# EAGLE schematic board1 (EAGLE 6.1)
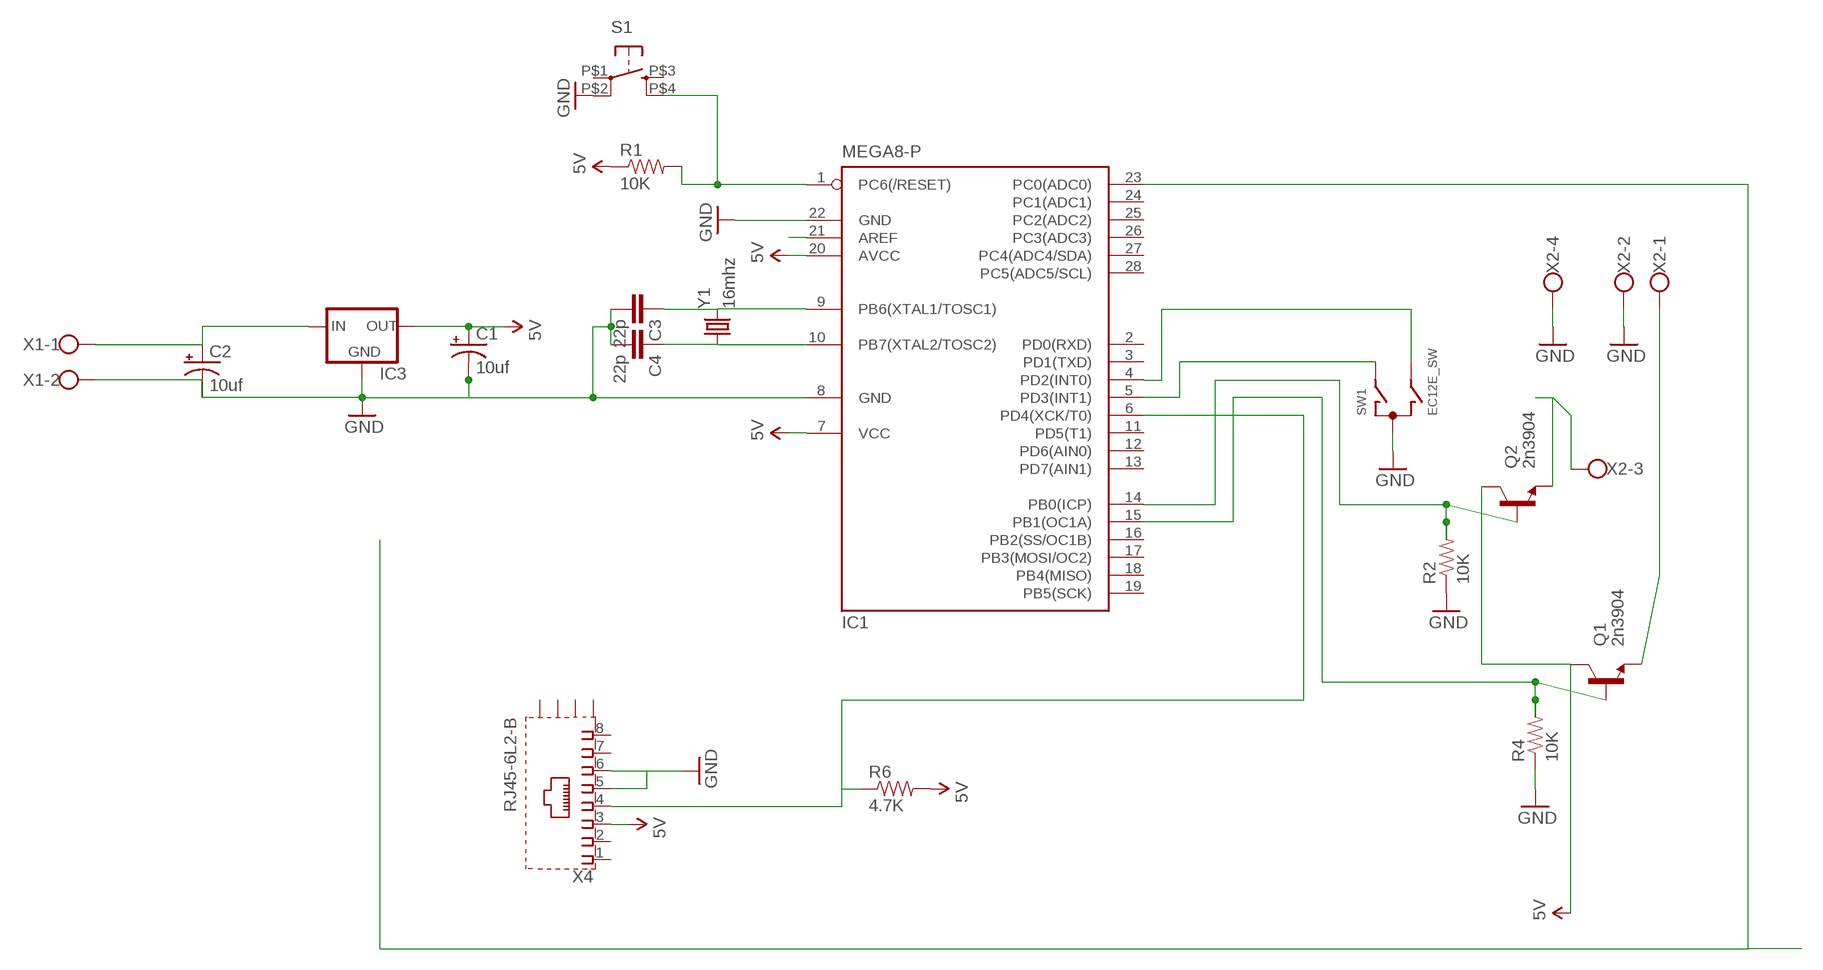
[diagram p0: schematic, sheet 1]

## Parts
C1  10uf  CAP_POLPTH2  [CPOL-RADIAL-10UF-25V]
C2  10uf  CAP_POLPTH2  [CPOL-RADIAL-10UF-25V]
C3  22p  CAP_  [AXIAL-5MM]
C4  22p  CAP_  [AXIAL-5MM]
IC1  MEGA8-P  [DIL28-3]
IC3  V_REG_78XXSINK  [TO220-IGO]
Q1  2n3904  TRANSISTOR_NPNTO-92-AMMO  [TO-92-AMMO]
Q2  2n3904  TRANSISTOR_NPNTO-92-AMMO  [TO-92-AMMO]
R1  10K  RESISTORAXIAL-0.3  [AXIAL-0.3]
R2  10K  RESISTORAXIAL-0.3  [AXIAL-0.3]
R4  10K  RESISTORAXIAL-0.3  [AXIAL-0.3]
R6  4.7K  RESISTORKIT  [AXIAL-0.3-KIT]
S1  TAC_SWITCHKSA_SEALED  [KSA_SEALED_TAC_SWITCH]
SW1  EC12E_SW  [ALPS_EC12E_SW]
X1  W237-102  [W237-102]
X2  W237-4  [W237-4]
X4  RJ45-6L2-B  [RJ45-SHIELD2]
Y1  16mhz  CRYSTALHC49US  [HC49US]

## Nets
5V: C1.1(+) IC1.7(VCC) IC1.20(AVCC) IC3.OUT Q1.3(C) Q2.3(C) R1.P$1 R6.P$2 X4.3
DALLASONEWIREBUS: IC1.6(PD4(XCK/T0)) R6.P$1 X4.4
GND: C1.2(-) C2.2(-) C3.P$2 C4.P$2 IC1.8(GND) IC1.22(GND) IC3.GND R2.P$1 R4.P$1 S1.P$2 SW1.C X1.2 X2.2 X2.4 X4.5 X4.6
N$1: IC1.1(PC6(/RESET)) R1.P$2 S1.P$4
N$2: C2.1(+) IC3.IN X1.1
N$3: C3.P$1 IC1.9(PB6(XTAL1/TOSC1)) Y1.2
N$4: C4.P$1 IC1.10(PB7(XTAL2/TOSC2)) Y1.1
N$5: IC1.4(PD2(INT0)) SW1.B
N$6: IC1.23(PC0(ADC0))
N$7: IC1.5(PD3(INT1)) SW1.A
N$14: IC1.15(PB1(OC1A)) Q1.2(B) R4.P$2
N$26: IC1.21(AREF)
N$28: Q2.1(E) X2.3
N$30: Q1.1(E) X2.1
N$31: IC1.14(PB0(ICP)) Q2.2(B) R2.P$2
Unconnected: IC1.2(PD0(RXD)) IC1.3(PD1(TXD)) IC1.11(PD5(T1)) IC1.12(PD6(AIN0)) IC1.13(PD7(AIN1)) IC1.16(PB2(SS/OC1B)) IC1.17(PB3(MOSI/OC2)) IC1.18(PB4(MISO)) IC1.19(PB5(SCK)) IC1.24(PC1(ADC1)) IC1.25(PC2(ADC2)) IC1.26(PC3(ADC3)) IC1.27(PC4(ADC4/SDA)) IC1.28(PC5(ADC5/SCL)) S1.P$1 S1.P$3 SW1.D SW1.E SW1.GND1(G) SW1.GND2(G) X4.1 X4.2 X4.7 X4.8 X4.S1(S) X4.S2(S) X4.S3(S) X4.S4(S)

## Library data of the parts
C1 C2 = SparkFun:CAP_POL: Capacitor Polarized These are standard SMD and PTH capacitors. Normally 10uF, 47uF, and 100uF in electrolytic and tantalum varieties. Always verify the external diameter of the through hole cap, it varies with capacity, voltage, and manufacturer. The EIA devices should be standard.
C3 C4 = SparkFun:CAP: Capacitor Standard 0603 ceramic capacitor, and 0.1" leaded capacitor.
IC1 = atmel:MEGA8-P: MICROCONTROLLER 8 Kbytes FLASH, 1 kbytes SRAM, 512 bytes EEPROM, USART, 4-channel 10 bit ADC, 2-channel 8 bit ADC Pin compatible with Atmega48, ATMega88, ATMega168 Source: avr.lbr; OC_FARNELL: unknown; OC_NEWARK: unknown
IC3 = SparkFun:V_REG_78XX: Voltage Regulator Standard 7805 5V regulator. IGO (Input Ground Output). Spark Fun Electronics SKU : COM-00107
Q1 Q2 = SparkFun:TRANSISTOR_NPN: Transistor NPN BJT configuration in SOT23 package. MMBT2222 is the common NPN we use. Double check BCE configuration again layout.
R1 R2 R4 R6 = SparkFun:RESISTOR: Resistor Basic schematic elements and footprints for 0603, 1206, and PTH resistors.
S1 = SparkFun:TAC_SWITCH: Momentary Switch Button commonly used for reset or general input. Spark Fun Electronics SKU : COM-00097
SW1 = switch-alps:EC12E_SW: ALPS rotary Encoder EC12E series with switch; MPN: EC12E2424407; OC_FARNELL: 1520813; OC_NEWARK: 74M1068
X1 = con-wago-500:W237-102: WAGO SCREW CLAMP; MPN: 237-102; OC_FARNELL: unknown; OC_NEWARK: 70K9898
X2 = con-wago-500:W237-4: WAGO SCREW CLAMP; OC_FARNELL: unknown; OC_NEWARK: unknown
X4 = con-tycoelectronics:RJ45*2: RJ45 Low Profile Shield Type 2 For all RJ45 L, LC, LCT and X Series Models Source: www.tycoelectronics.com .. ENG_DS_1654001_1099_RJ_L_0507.pdf; MPN: RJ45-6L2-B; OC_FARNELL: unknown; OC_NEWARK: 16R6096
Y1 = SparkFun:CRYSTAL: Crystals Various standard crystals. Proven footprints. Spark Fun Electronics SKU : COM-00534